# Altium schematic sheet ADCset.SCHDOC
size A
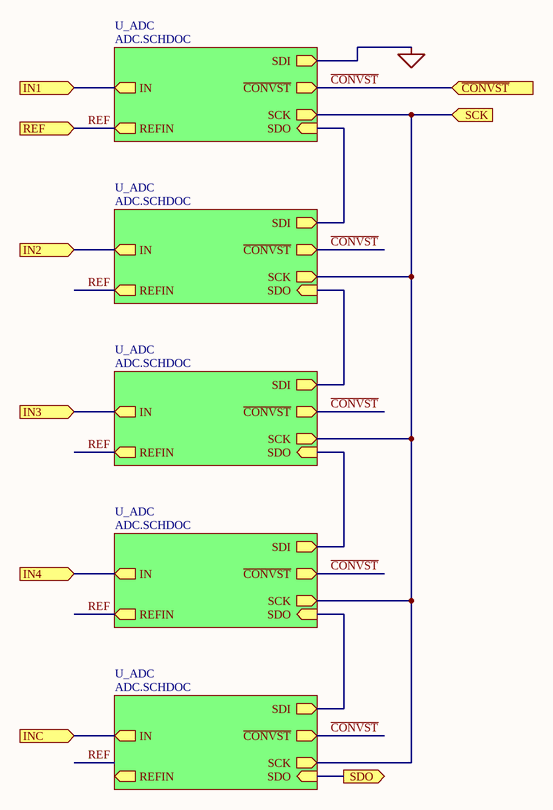
[diagram p0: ADCset.SCHDOC]

## Sub-sheets
U_ADC = ADC.SCHDOC: REFIN (out), IN (out), ~{CONVST} (out), SCK (out), SDO (in), SDI (out)
U_ADC = ADC.SCHDOC: REFIN (out), IN (out), ~{CONVST} (out), SCK (out), SDO (in), SDI (out)
U_ADC = ADC.SCHDOC: REFIN (out), IN (out), ~{CONVST} (out), SCK (out), SDO (in), SDI (out)
U_ADC = ADC.SCHDOC: REFIN (out), IN (out), ~{CONVST} (out), SCK (out), SDO (in), SDI (out)
U_ADC = ADC.SCHDOC: REFIN (out), IN (out), ~{CONVST} (out), SCK (out), SDO (in), SDI (out)

## Ports
IN1 (in), IN2 (in), IN3 (in), IN4 (in), INC (in), REF (in), SCK (in), SDO (out), ~{CONVST} (in)

## Nets
AGND: sheet U_ADC/SDI
~{CONVST}: port ~{CONVST}, sheet U_ADC/~{CONVST}, sheet U_ADC/~{CONVST}, sheet U_ADC/~{CONVST}, sheet U_ADC/~{CONVST}, sheet U_ADC/~{CONVST}
IN1: port IN1, sheet U_ADC/IN
IN2: port IN2, sheet U_ADC/IN
IN3: port IN3, sheet U_ADC/IN
IN4: port IN4, sheet U_ADC/IN
INC: port INC, sheet U_ADC/IN
REF: port REF, sheet U_ADC/REFIN, sheet U_ADC/REFIN, sheet U_ADC/REFIN, sheet U_ADC/REFIN
SCK: port SCK, sheet U_ADC/SCK, sheet U_ADC/SCK, sheet U_ADC/SCK, sheet U_ADC/SCK, sheet U_ADC/SCK
SDO: port SDO, sheet U_ADC/SDO
(unnamed): sheet U_ADC/SDO, sheet U_ADC/SDI
(unnamed): sheet U_ADC/SDO, sheet U_ADC/SDI
(unnamed): sheet U_ADC/SDO, sheet U_ADC/SDI
(unnamed): sheet U_ADC/SDO, sheet U_ADC/SDI